# EAGLE design Trinket M0 rev D (EAGLE 6.4)
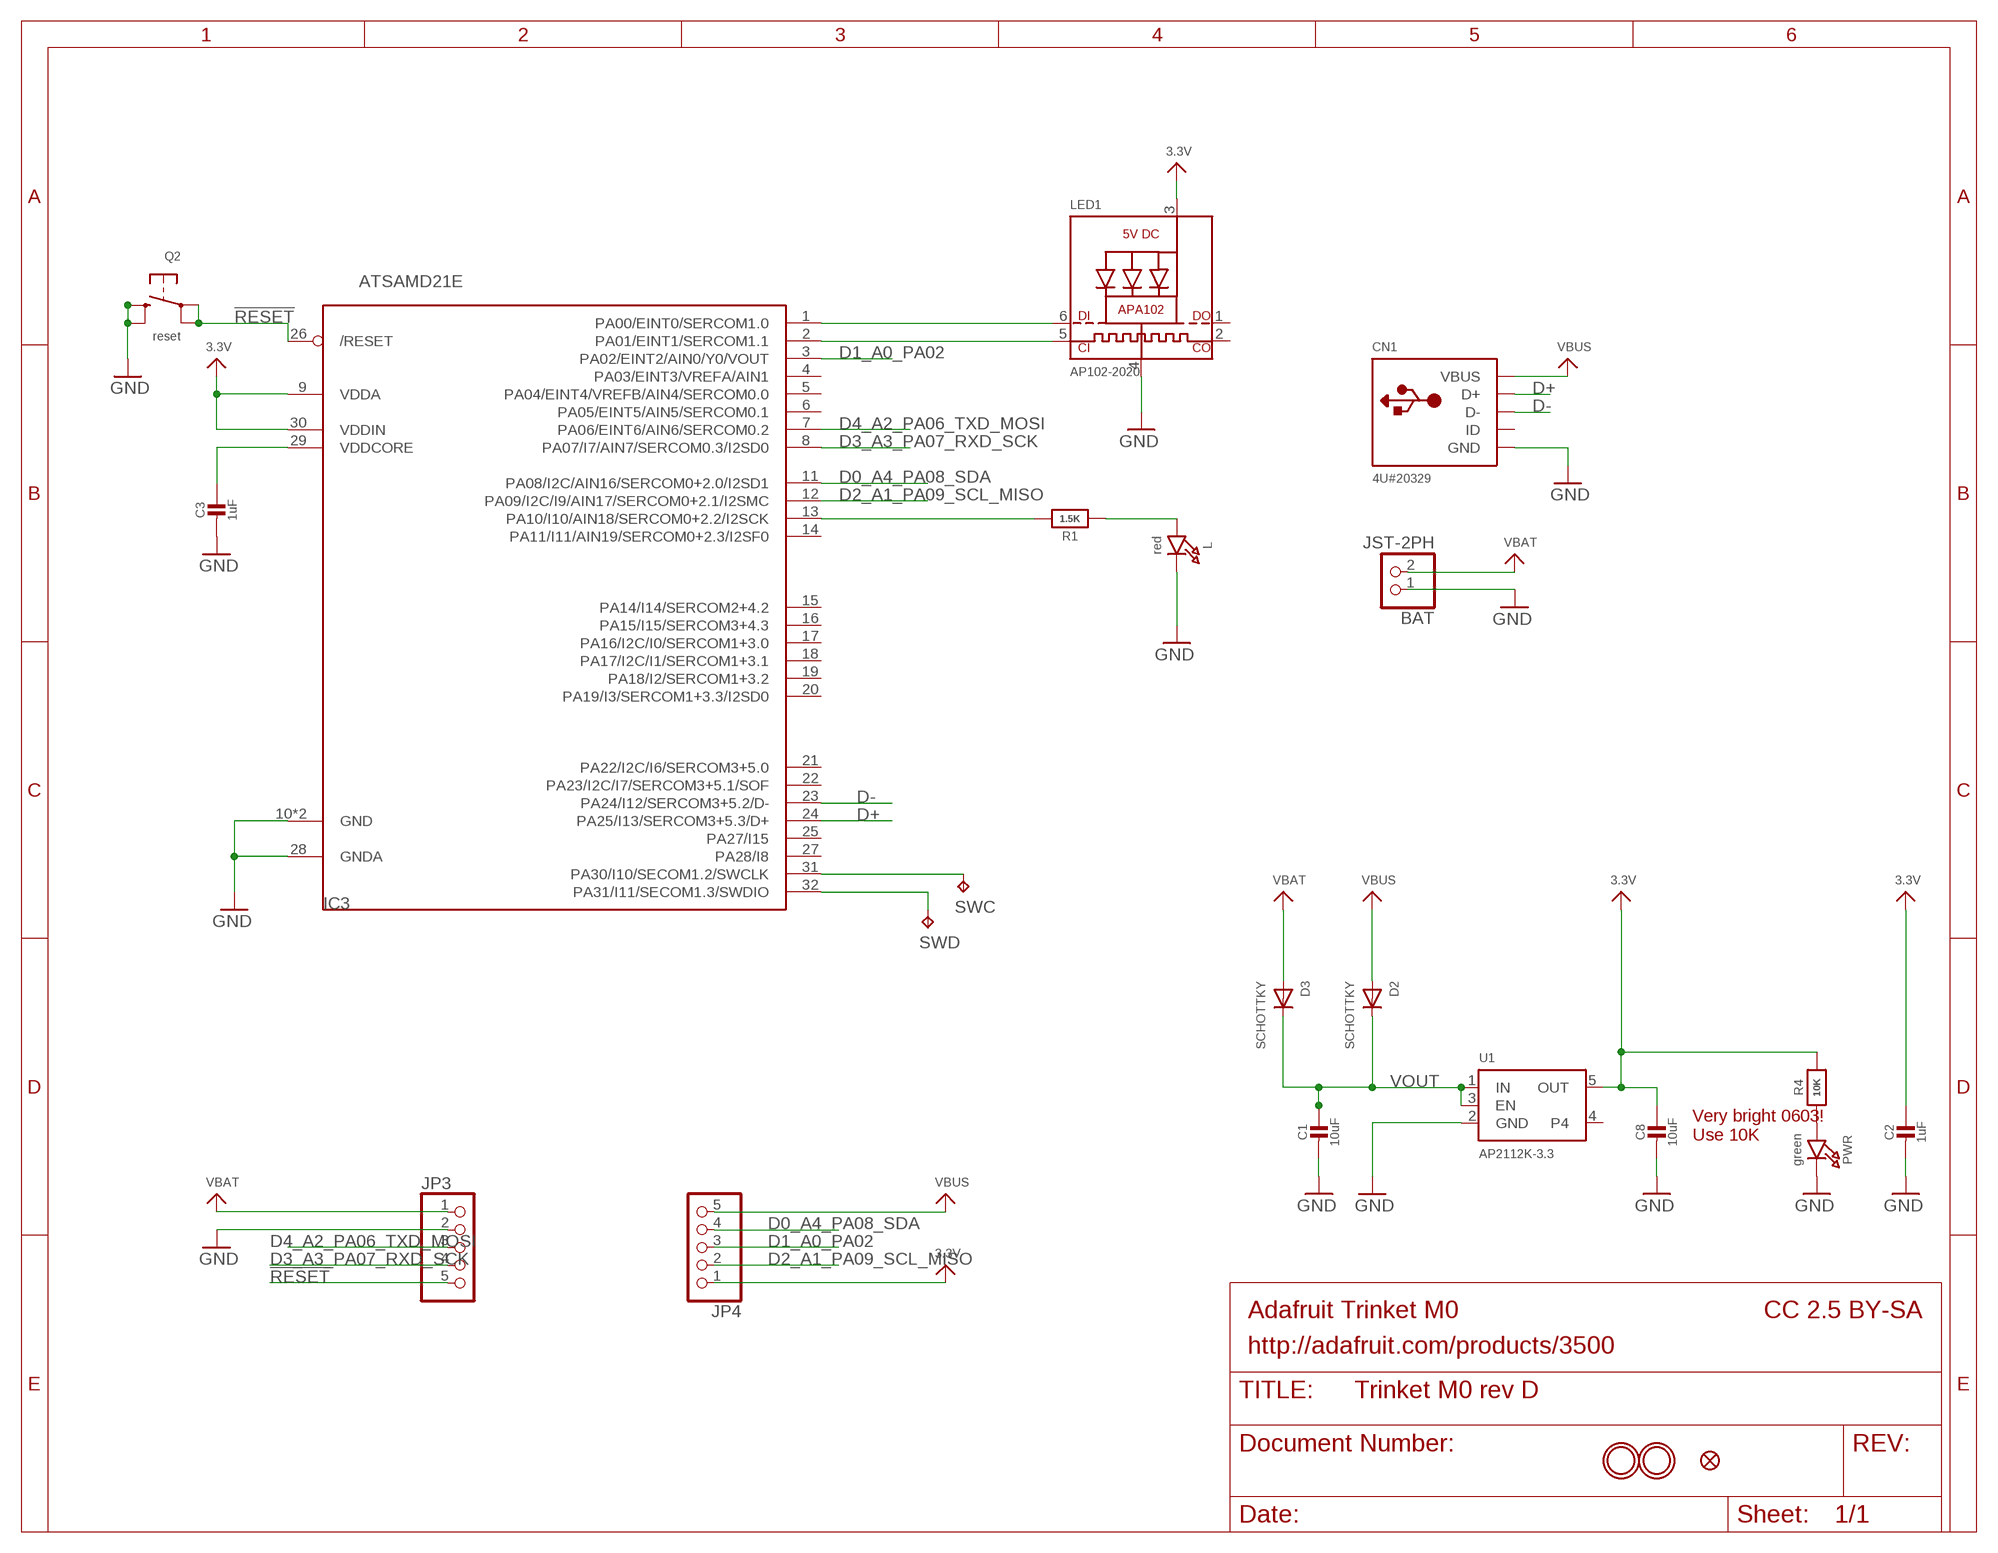
[diagram p0: schematic, sheet 1]

## Parts
BAT  JST-2PH  CON_JST_PH_2PIN  [JSTPH2]
C1  10uF  CAP_CERAMIC0805-NOOUTLINE  [0805-NO]
C2  1uF  CAP_CERAMIC0603_NO  [0603-NO]
C3  1uF  CAP_CERAMIC0603_NO  [0603-NO]
C8  10uF  CAP_CERAMIC0805-NOOUTLINE  [0805-NO]
CN1  4U#20329  USB_MICRO_20329_V2  [4UCONN_20329_V2]
D2  SCHOTTKY  DIODE_SOD-123FL  [SOD-123FL]
D3  SCHOTTKY  DIODE_SOD-123FL  [SOD-123FL]
IC3  ATSAMD21E  [QFN32_5MM]
JP3  HEADER-1X576MIL  [1X05_ROUND_76]
JP4  HEADER-1X576MIL  [1X05_ROUND_76]
L  red  LED0603_NOOUTLINE  [CHIPLED_0603_NOOUTLINE]
LED1  AP102-2020  APA1022020  [APA102_2020]
PWR  green  LED0603_NOOUTLINE  [CHIPLED_0603_NOOUTLINE]
Q2  reset  SWITCH_TACT_SMT4.6X2.8  [BTN_KMR2_4.6X2.8]
R1  1.5K  RESISTOR_0603_NOOUT  [0603-NO]
R4  10K  RESISTOR_0603_NOOUT  [0603-NO]
SWC  TPB1,27  [B1,27]
SWD  TPB1,27  [B1,27]
U1  AP2112K-3.3  VREG_SOT23-5  [SOT23-5]
U$6  FIDUCIAL_1MM  [FIDUCIAL_1MM]
U$8  MOUNTINGHOLE2.0  [MOUNTINGHOLE_2.0_PLATED]
U$9  MOUNTINGHOLE2.0  [MOUNTINGHOLE_2.0_PLATED]

## Nets
3.3V: C2.1 C8.1 IC3.9(VDDA) IC3.30(VDDIN) JP4.1 LED1.3(VDD) R4.2 U1.5(OUT)
!RESET: IC3.26(/RESET) JP3.5 Q2.A'(P1) Q2.A(P)
A3: IC3.1(PA00/EINT0/SERCOM1.0) LED1.6(DI)
D0_A4_PA08_SDA: IC3.11(PA08/I2C/AIN16/SERCOM0+2.0/I2SD1) JP4.4
D1_A0_PA02: IC3.3(PA02/EINT2/AIN0/Y0/VOUT) JP4.3
D2_A1_PA09_SCL_MISO: IC3.12(PA09/I2C/I9/AIN17/SERCOM0+2.1/I2SMC) JP4.2
D3_A3_PA07_RXD_SCK: IC3.8(PA07/I7/AIN7/SERCOM0.3/I2SD0) JP3.4
D4_A2_PA06_TXD_MOSI: IC3.7(PA06/EINT6/AIN6/SERCOM0.2) JP3.3
D+: CN1.D+ IC3.24(PA25/I13/SERCOM3+5.3/D+)
D-: CN1.D- IC3.23(PA24/I12/SERCOM3+5.2/D-)
GND: BAT.1 C1.2 C2.2 C3.2 C8.2 CN1.BASE@1(GND) CN1.BASE@2(GND) CN1.GND CN1.SPRT@1(GND) CN1.SPRT@2(GND) CN1.SPRT@3(GND) CN1.SPRT@4(GND) IC3.10(GND) IC3.28(GNDA) IC3.33(GND) JP3.2 L.C LED1.4(GND) PWR.C Q2.B'(S1) Q2.B(S) U1.2(GND)
N$1: L.A R1.1
N$2: IC3.13(PA10/I10/AIN18/SERCOM0+2.2/I2SCK) R1.2
N$3: IC3.31(PA30/I10/SECOM1.2/SWCLK) SWC.TP
N$4: IC3.32(PA31/I11/SECOM1.3/SWDIO) SWD.TP
N$6: PWR.A R4.1
N$8: IC3.2(PA01/EINT1/SERCOM1.1) LED1.5(CKI)
VBAT: BAT.2 D3.A JP3.1
VBUS: CN1.VBUS D2.A JP4.5
VDDCORE: C3.1 IC3.29(VDDCORE)
VOUT: C1.1 D2.C D3.C U1.1(IN) U1.3(EN)
Unconnected: CN1.ID IC3.4(PA03/EINT3/VREFA/AIN1) IC3.5(PA04/EINT4/VREFB/AIN4/SERCOM0.0) IC3.6(PA05/EINT5/AIN5/SERCOM0.1) IC3.14(PA11/I11/AIN19/SERCOM0+2.3/I2SF0) IC3.15(PA14/I14/SERCOM2+4.2) IC3.16(PA15/I15/SERCOM3+4.3) IC3.17(PA16/I2C/I0/SERCOM1+3.0) IC3.18(PA17/I2C/I1/SERCOM1+3.1) IC3.19(PA18/I2/SERCOM1+3.2) IC3.20(PA19/I3/SERCOM1+3.3/I2SD0) IC3.21(PA22/I2C/I6/SERCOM3+5.0) IC3.22(PA23/I2C/I7/SERCOM3+5.1/SOF) IC3.25(PA27/I15) IC3.27(PA28/I8) LED1.1(DO) LED1.2(CKO) U1.4

## Notes on the sheet
- Very bright 0603!
  Use 10K
- Adafruit Trinket M0 | CC 2.5 BY-SA
- http://adafruit.com/products/3500

## Library data of the parts
BAT = microbuilder:CON_JST_PH_2PIN: JST 2-Pin Right-Angle Connector PH-Series - 4UConnector: 17311 SH-Series - 4UConnector: 07278
C1-C3 C8 = microbuilder:CAP_CERAMIC: Ceramic Capacitors For new designs, use the packages preceded by an '_' character since they are more reliable: The following footprints should be used on most boards: _0402 - Standard footprint for regular board layouts _0603 - Standard footprint for regular board layouts _0805 - Standard footprint for regular board layouts _1206 - Standard footprint for regular board layouts For extremely tight-pitch boards where space is at a premium, the following 'micro-pitch' footprints can be used (smaller pads, no silkscreen outline, etc.): _0402MP - Micro-pitch footprint for very dense/compact boards _0603MP - Micro-pitch footprint for very dense/compact boards _0805MP - Micro-pitch footprint for very dense/compact boards _1206MP - Micro-pitch footprint for very dense/compact boards
CN1 = microbuilder:USB: USB Connectors USBMINIB - Surface Mount Female Mini-B USB Connector 4UConnector: 06564
D2 D3 = adafruit:DIODE: Diode SMADIODE - SMA Surface Mount Package 20V 1A Schottky Diode Digikey: 641-1014-6-ND DO-1N4148 - Through Hole Small Current Diode SOD-123 20V 1 A (.5mV Vf) Schottky Diode - Digikey: MBRX120TPMSCT-ND SOD-323 10V 570mA (.38mV Vf, 3ns) Schottky Diode - Digikey: ZLLS410CT-ND SOD-523 30V 30mA Schottky Diode (RB751S-40TE61) - Digikey: RB751S-40TE61CT-ND SOT23-R/W - SOT23 Package (R = Solder Paste/Reflow Ovens, W = Hand-Soldering) BAT54Film 40V 300mA - Digikey: 497-7162-1-ND
IC3 = microbuilder:ATSAMD21E
JP3 JP4 = microbuilder:HEADER-1X5: PIN HEADER
L PWR = microbuilder:LED: LED 0603 - 0603 Surface Mount Package 2mA: Green LED - Low Power (3.9mcd, 2ma, 1.7Vf) - Digikey: 475-2709-2-ND Orange LED - Low Power (9.8mcd, 2ma, 1.8Vf) - Digikey: 475-1194-2-ND Red LED - Low Power (5mcd, 2ma, 1.8Vf) - Digikey: 475-1195-2-ND Yellow LED - Low Power (7mcd, 2ma, 1.8Vf) - Digikey: 475-1196-2-ND 5mA: Blue LED - Low Power (17mcd, 5ma, 2.9Vf) - Digikey: LNJ937W8CRACT-ND 0805 - 0805 Surface Mount Package 2mA: Red LED (8.8mcd, 2mA, 1.8Vf, Clear) - Low Power [Digikey: 475-2510-1-ND] Green LED (5mcd, 2mA, 1.8Vf, Clear) - Low Power [Digikey: 475-2730-1-ND] Yellow LED (11.3mcd, 2mA, 1.8Vf, Clear) - Low Power [Digikey: 475-2555-1-ND] 20mA: Red LED (104mcd, 20mA, Diffused) - LS R976 [Digikey: 475-1278-6-ND] Red LED (12mcd, 20mA, 2.0Vf, Clear) - APT2012EC [Digikey: 754-1128-1-ND] Green LED (15mcd, 20mA, 2.2Vf, Clear) - APT2012GC [Digikey: 754-1131-1-ND] Orange LED (160mcd, 20mA, 2.1Vf, Clear) - APT2012SECK [Digikey: 754-1130-1-ND] 1206 - 1206 Surface Mount Package Green LED (26mcd, 20mA, Diffused) - LG N971 [Digikey: 475-1407-6-ND] Red LED (15mcd, 20mA, Diffused) - LH N974 [Digikey: 475-1416-6-ND] Cree - Cree High-Power Surface Mount LEDs XPEBWT-L1-0000-00D50 - White 111lm 350mA 2.9Vf 6200K 110° XTEAWT-00-0000-00000LEE3 - White 114lm 350mA 2.85Vf 5000K 115° Everlight - Everlight 45-21 Series Surface Mount LEDs 45-21/QK2C-B2832AC2CB2/2T - Warm White 2000mcd 20mA 3.25Vf 3050K 120° 45-21/LK2C-B38452C4CB2/2T - Nuetral White 2000mcd 20mA 3.25Vf 4150K 120° 45-21/LK2C-B50634C6CB2/2T - Cold White 2200mcd 20mA 3.25Vf 5650K 120° PLCC2 Reverse Mount LS T77K-J1L2-1-0-2-R18-Z - Red 11.25mcd 2mA 1.8Vf 630nm 120° LO T77K-L1M2-24-Z - Orange 19.6mcd 2mA 1.8Vf 606nm 120° LY T77K-K2M1-26-Z - Yellow 15.7mcd 2mA 1.8Vf 587nm 120°
LED1 = microbuilder:APA102: APA102/DotStar Pixels VCC: 5V DC Refresh Rate: 400Hz
Q2 = microbuilder:SWITCH_TACT_SMT: SMT Tact Switches 6x6mm - Digikey: P12940SCT-ND KMR2 (4.6x2.8mm) - Digikey: 401-1426-1-ND EVQ-PQHB55 - Light Touch, 160GF (4.5x4.5mm) - Digikey: P8090SCT-ND KMT0 - KMT021 NGJ LHS (etc.) IP68/Waterproof - Digikey: CKN10289CT-ND
R1 R4 = microbuilder:RESISTOR: Resistors For new designs, use the packages preceded by an '_' character since they are more reliable: The following footprints should be used on most boards: _0402 - Standard footprint for regular board layouts _0603 - Standard footprint for regular board layouts _0805 - Standard footprint for regular board layouts _1206 - Standard footprint for regular board layouts For extremely tight-pitch boards where space is at a premium, the following 'micro-pitch' footprints can be used (smaller pads, no silkscreen outline, etc.): _0402MP - Micro-pitch footprint for very dense/compact boards _0603MP - Micro-pitch footprint for very dense/compact boards _0805MP - Micro-pitch footprint for very dense/compact boards _1206MP - Micro-pitch footprint for very dense/compact boards
SWC SWD = testpad:TP: Test pad
U1 = microbuilder:VREG_SOT23-5: SOT23-5 Fixed Voltage Regulators Part Current Out V Out V In V Dropout θJA (°C/W) TJ (°C) Digikey Part No. ADP121 150mA 3.3V 3.4-5.5V 0.09V @ 150mA -- -- ADP121-AUJZ33R7CT-ND ADP121 150mA 3.0V 3.1-5.5V 0.09V @ 150mA -- -- ADP121-AUJZ30R7CT-ND ADP122 300mA 3.3V 3.4-5.5V 0.085V @ 300mA -- -- ADP122AUJZ-3.3-R7CT-ND ADP1712 300mA 3.3V 3.5-5.5V 0.17V @ 300mA -- -- ADP1712AUJZ-3.3-R7TR-ND AP7311 (Low Cost) 150mA 3.3V 3.5-6V 0.15V @ 150mA -- -- AP7311-33WG-7DICT-ND LD39015M18R 150mA 1.8V 1.9V-5.5V 0.08V @ 100mA -- -- 497-6977-1-ND LP2985A-33DBVR 150mA 3.3V 3.3-16V 0.28V @ 150mA 206 150 296-18479-1-ND MCP1824T-3302E/OT 300mA 3.3V 3.5V-6V 0.2V @ 300mA -- -- MCP1824T-3302E/OTCT-ND MIC5205-2.5YM5 TR 150mA 2.5V 2.7-16V 0.165V @ 150mA -- -- 576-1257-2-ND MIC5205-3.0YM5 TR 150mA 3.0V 3.2V-16V 0.165V @ 150mA -- -- 576-1258-2-ND MIC5205-3.3YM5 TR 150mA 3.3V 3.5V-16V 0.165V @ 150mA -- -- 576-1259-2-ND TPS780330220 150mA 3.3V+2.2V 3.6-5.5V 250mV Max -- -- 296-23332-1-ND TDA3663/N1,135 100mA 3.3V 3.5-45V 0.18V @ 50mA -- -- 568-5343-1-ND Max operating temp can be calculated using θJA, TJ (max junction temperature), and power in watts. Set the "Maximum Ambient Temperature" until it reaches TJ ("Max Junction Temperature"), which is the absolute limit for safe use of the regulator: Heat Sink Temperature Calculator <http://www.daycounter.com/Calculators/Heat-Sink-Temperature-Calculator.phtml> For example, With 12V source into a 3.3V LP2985 and a 30mA load, we are dissipating (12V-3.3V) * 0.03A = 0.261W. With a θJA of 206 °C/W, a TJ of 150°C, and 261mW we can safely use the chip without a heat sink up to 75°C (=147.1°C Junction Temperature).
U$6 = microbuilder:FIDUCIAL: Fiducial Alignment Points Various fiducial points for machine vision alignment.; BOM: EXCLUDE
U$8 U$9 = microbuilder:MOUNTINGHOLE: Mounting Hole For #2 screws (0.086"/2.18mm width, 0.094"/2.4mm hole) use 2.5mm; BOM: EXCLUDE

## Net classes
1 power: width 0.305 mm

## Board
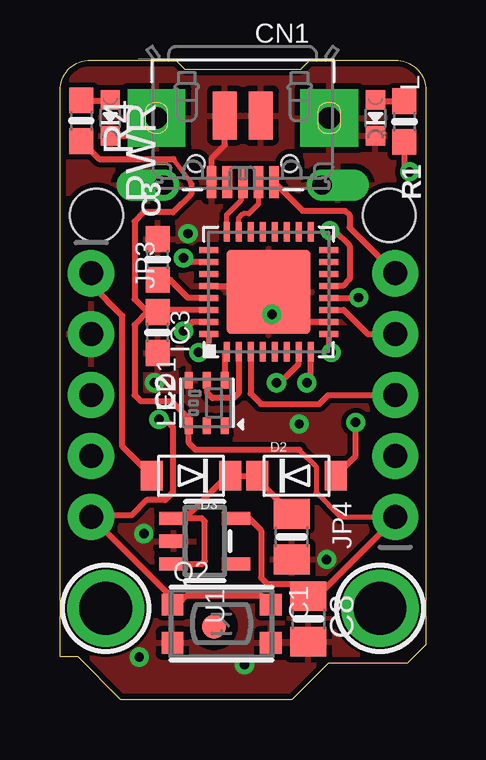
[diagram p1: board, top side]
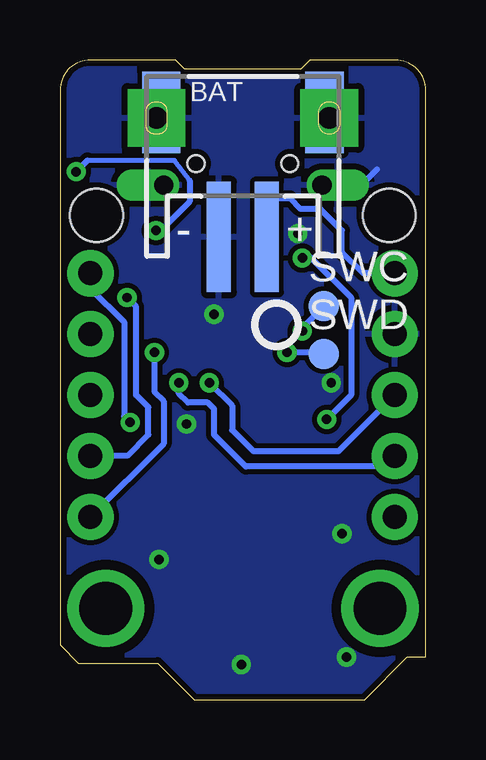
[diagram p2: board, bottom side, seen from below]

Size 15.24 x 26.67 mm. Coordinates in mm from the lower left corner, seen from the top.
Outline: 15.24,25.4 15.24,2.29 14.48,1.52 11.18,1.52 9.65,0 2.54,0 0.76,1.78 0,1.78 0,25.4 arc-90 1.27,26.67 4.83,26.67 5.21,26.29 10.03,26.29 10.41,26.67 13.97,26.67 arc-90 15.24,25.4
Copper layers (1*16): Top 0.035mm / dielectric 1.5mm / Bottom 0.035mm
Design rules "adafruit *": minimum track width 8mil, minimum drill 15.5mil, track to track 8mil, track to pad 8mil, pad to pad 8mil, via to via 8mil, smd to smd 8mil, copper to edge 10mil, drill to drill 8mil, minimum pad ring 10mil, minimum via ring 8mil, stop-mask expansion 2mil, vias tented up to drill 20mil, thermal gap 10mil
Holes 2.2 mm at 1.52,20.19 13.72,20.19

### Footprints (pad centres in the part's own frame; a part is rotated, then mirrored left to right if it is on the bottom)
JSTPH2 = smd 1 x 4.6: 1 -1,-3.7; 2 1,-3.7 | smd 1.6 x 3.4: NC1 -3.4,1.5; NC2 3.4,1.5
0805-NO = smd 1.24 x 1.5: 1 -0.95,0; 2 0.95,0
0603-NO = smd 1.075 x 1: 1 -0.85,0; 2 0.85,0
4UCONN_20329_V2 = smd 1 x 2: BASE@1 -0.75,-2; BASE@2 0.75,-2 | smd 0.4 x 1.35: D+ 0,0.775; D- -0.65,0.775; GND 1.3,0.775; ID 0.65,0.775; VBUS -1.3,0.775 | drill 0.8 pad 1.143 offset: SPRT@1 -3.3,0.9; SPRT@2 3.3,0.9 | drill 0.9 pad 2.413 square: SPRT@3 -3.6,-1.9; SPRT@4 3.6,-1.9 | hole 0.7: -1.95,0; 1.95,0
SOD-123FL = smd 0.91 x 1.22: A 1.637,0; C -1.637,0
QFN32_5MM = smd 0.8 x 0.25: 1 -2.5,1.75; 2 -2.5,1.25; 3 -2.5,0.75; 4 -2.5,0.25; 5 -2.5,-0.25; 6 -2.5,-0.75; 7 -2.5,-1.25; 8 -2.5,-1.75; 17 2.5,-1.75; 18 2.5,-1.25; 19 2.5,-0.75; 20 2.5,-0.25; 21 2.5,0.25; 22 2.5,0.75; 23 2.5,1.25; 24 2.5,1.75 | smd 0.25 x 0.8: 9 -1.75,-2.5; 10 -1.25,-2.5; 11 -0.75,-2.5; 12 -0.25,-2.5; 13 0.25,-2.5; 14 0.75,-2.5; 15 1.25,-2.5; 16 1.75,-2.5; 25 1.75,2.5; 26 1.25,2.5; 27 0.75,2.5; 28 0.25,2.5; 29 -0.25,2.5; 30 -0.75,2.5; 31 -1.25,2.5; 32 -1.75,2.5 | smd 3.5 x 3.5: 33 0,0
1X05_ROUND_76 = drill 1 pad 1.93: 1 -5.08,0; 2 -2.54,0; 3 0,0; 4 2.54,0; 5 5.08,0
CHIPLED_0603_NOOUTLINE = smd 0.8 x 0.8: A 0,-0.75; C 0,0.75
APA102_2020 = smd 0.7 x 0.35: 1 -0.95,-0.75; 2 -0.95,0; 3 -0.95,0.75; 4 0.95,0.75; 5 0.95,0; 6 0.95,-0.75
BTN_KMR2_4.6X2.8 = smd 0.9 x 0.9: A 2.05,0.8; A' -2.05,0.8; B 2.05,-0.8; B' -2.05,-0.8
B1,27 = smd 1.27 x 1.27: TP 0,0
SOT23-5 = smd 0.55 x 1.2: 1 -0.95,-1.3; 2 0,-1.3; 3 0.95,-1.3; 4 0.95,1.3; 5 -0.95,1.3
FIDUCIAL_1MM = smd 1 x 1: 1 0,0
MOUNTINGHOLE_2.0_PLATED = drill 2.2 pad 3: P$1 0,0

### Placement (x,y rotation side)
BAT  7.62,22.99 0 bottom
C1  9.65,6.79 270 top
C2  4.06,15.3 270 top
C3  4.06,18.35 90 top
C8  10.35,3.37 270 top
CN1  7.62,22.35 180 top
D2  9.86,9.33 0 top
D3  5.46,9.33 180 top
IC3  8.69,17 90 top
JP3  1.3,12.7 270 top
JP4  13.97,12.7 90 top
L  13.14,24.26 180 top
LED1  6.12,12.37 90 top
PWR  2.1,24.26 180 top
Q2  6.73,3.17 0 top
R1  14.35,24.1 270 top
R4  0.89,24.13 270 top
SWC  4.25,16.41 0 bottom
SWD  4.25,14.41 0 bottom
U1  6.03,6.6 270 top
U$1  [TRINKET_M0_BOTTOM]  15.24,0 0 bottom
U$6  6.41,3.05 0 top
U$8  1.91,3.81 0 top
U$9  13.34,3.81 0 top
U$12  [PCBFEAT-REV-040]  6.22,15.62 90 bottom
U$20  [TRINKET_M0_TOP]  0,0 0 top

### Tracks (layer width: path | path; a pad name or v marks a point on that pad's centre or on a via)
3.3V  (via drill 0.39)
  Top 0.203: 4.72,22.54 5.46,21.53 | 9.97,10.41 10.67,9.71 10.67,8.64 11.68,7.62 JP4.1
  Top 0.254: C2.1 3.64,16.15 3.11,15.62 3.11,12.7 3.37,12.45 4.63,12.45 5.37,11.71 LED1.3 | 5.37,11.65 LED1.3 | JP4.1 13.97,7.56 10.73,4.32 C8.1 10.35,4.38 9.91,4.83 8.64,4.83 8.38,5.08 8.38,7.05 7.88,7.55 U1.5 | R4.2 1.63,22.54 4.72,22.54 | 5.46,21.53 5.46,21.08 4.7,20.32 3.49,20.32 3.11,19.94 3.11,16.7 3.56,16.26 3.96,16.26 C2.1 | IC3.9 11.19,14.59 v11.3,14.48 | IC3.30 4.16,16.25 C2.1 | 9.97,10.41 5.65,10.41 5.37,10.7 LED1.3
  Bottom 0.254: v11.3,14.48 11.3,12.83 10.92,12.45 10.92,10.67 JP4.1
!RESET  (via drill 0.39)
  Top 0.254: Q2.A 8.43,4.32 5.27,4.32 4.92,3.97 Q2.A' 4.68,4.23 JP3.5 1.36,7.68 2.98,7.68 3.62,8.32 4.38,8.32 4.7,8.64 4.7,11.37 4.38,11.68 v4.13,11.68 | IC3.26 5.24,18.25 arc-90 v5.14,18.41
  Bottom 0.254: v5.14,18.41 4.76,18.41 3.11,16.76 3.11,12.7 v4.13,11.68
A3
  Top 0.254: IC3.1 6.87,14.43 LED1.6
D0_A4_PA08_SDA
  Top 0.254: IC3.11 11.81,16.25 12.83,15.24 JP4.4
D1_A0_PA02
  Top 0.254: IC3.3 7.94,12.76 8.38,12.32 10.79,12.32 11.18,12.7 JP4.3
D2_A1_PA09_SCL_MISO  (via drill 0.39)
  Top 0.254: v12.46,16.75 v12.45,16.76 12.44,16.75 IC3.12
  Bottom 0.254: JP4.2 12.45,10.16 11.56,11.05 11.56,12.19 12.07,12.7 12.07,16.38 v12.45,16.76
D3_A3_PA07_RXD_SCK  (via drill 0.39)
  Top 0.254: v10.29,13.21 10.44,13.36 IC3.8
  Bottom 0.254: JP3.4 1.74,9.71 7.49,9.71 8.83,11.05 8.83,12.13 9.08,12.38 9.91,12.38 10.29,12.76 v10.29,13.21
D4_A2_PA06_TXD_MOSI  (via drill 0.39)
  Top 0.254: v9.02,13.21 9.15,13.21 9.94,14 IC3.7
  Bottom 0.254: JP3.3 3.65,10.35 7.17,10.35 8.06,11.24 8.06,12.26 v9.02,13.21
D+
  Top 0.203: IC3.24 6.94,20.21 7.56,20.83 7.56,21.51
  Top 0.254: 7.56,21.51 CN1.D+
D-
  Top 0.203: CN1.D- 8.27,20.65 7.87,20.26 7.62,20.26 7.44,20.08 IC3.23
GND  (via drill 0.39)
  Top 0.254: v8.83,16.07 8.69,16.2 IC3.33 arc90 8.44,17.25 IC3.28 | 8.83,15.88 v8.83,16.07 | CN1.GND 6.32,22.58 6.87,23.13 CN1.BASE@2 | IC3.10 9.14,15.75 arc-90 v8.83,16.07 | PWR.C 3.28,23.51 CN1.SPRT@4
  Bottom 0.254: CN1.SPRT@2 2.68,21.45 2.03,22.1
  other vias: 3.3,1.78 3.49,6.92 11.11,5.84 7.68,1.46 3.94,13.21 5.33,19.43 9.97,11.49
  pour Bottom: 0,26.67 0,0 15.24,0 15.24,26.67
  pour Top: 0,26.67 0,0 15.24,0 15.24,26.67
N$1
  Top 0.254: L.A 13.2,24.95 R1.1
N$2  (via drill 0.39)
  Top 0.254: IC3.13 11.79,17.25 12.07,17.53 12.07,18.92 11.43,19.56 v11.24,19.56 | R1.2 14.35,22.23 v14.57,22.01
  Bottom 0.203: 9.84,21.64 10.48,22.48 14.1,22.48
  Bottom 0.254: 9.84,21.64 9.84,20.77 11.05,19.56 v11.24,19.56 | 14.1,22.48 v14.57,22.01
N$3  (via drill 0.39)
  Top 0.254: IC3.31 5.53,15.75 v5.14,15.37
  Bottom 0.254: SWC.TP 4.25,16.38 5.14,15.49 5.14,15.46 v5.14,15.37
N$4  (via drill 0.39)
  Top 0.254: IC3.32 6.19,14.89 v5.78,14.48
  Bottom 0.254: SWD.TP 4.32,14.48 v5.78,14.48
N$6
  Top 0.254: R4.1 2.1,24.98 PWR.A
N$8
  Top 0.254: LED1.5 6.12,12.81 6.35,12.57 7.24,12.57 7.44,12.78 IC3.2
VBAT
  Top 0.254: JP3.1 1.29,17.31 2.6,16 2.6,10.55 D3.A
  Bottom 0.254: JP3.1 2.6,17.78 3.49,18.67 3.49,19.56 4.39,20.46 5.22,20.46 5.65,20.89 6.6,20.89 6.62,20.88 BAT.2
VBUS  (via drill 0.39)
  Top 0.254: CN1.VBUS 10.11,20.38 11.88,20.38 12.07,20.19 12.07,19.69 JP4.5 | D2.A 12.32,10.16 v12.32,11.56
  Bottom 0.254: JP4.5 13.97,17.14 12.57,15.75 12.57,11.81 v12.32,11.56
VDDCORE
  Top 0.254: IC3.29 5.35,16.75 4.6,17.5 C3.1
VOUT
  Top 0.254: D2.C D3.C 7.1,9.45 5.2,7.55 U1.1 5.91,7.56 6.03,7.43 6.03,5.78 5.91,5.65 U1.3 | D2.C 8.22,9.24 | C1.1 8.22,9.18 D2.C

### Text on the board
bPlace: + | -
tDocu: D0/A4/SDA | D4/A2/RXD/MOSI | D1/A0/VOUT | D3/A3/TXD/SCK | D2/A1/SCL/MISO